# EAGLE schematic IMU (EAGLE 9.6.2)
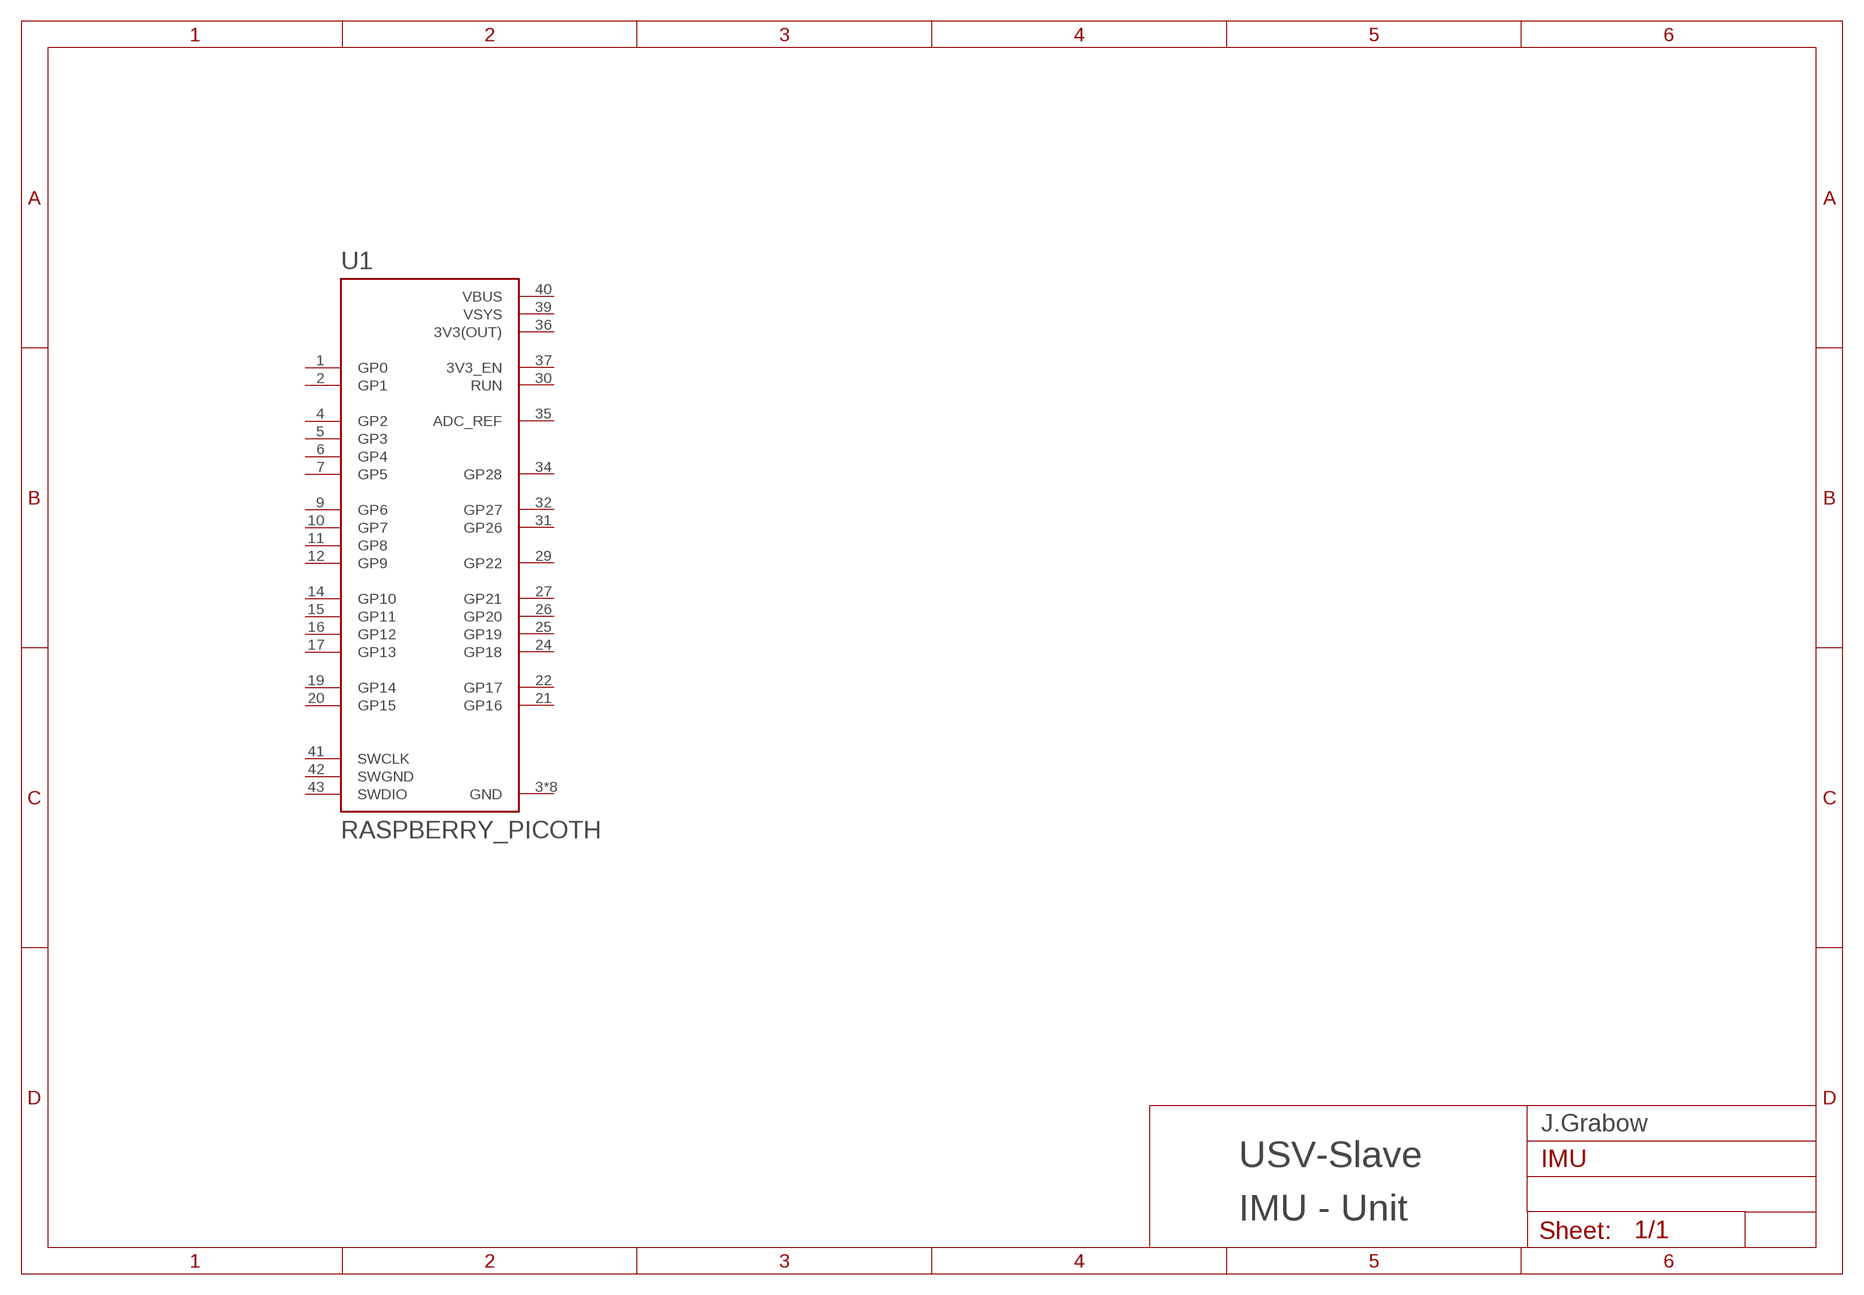
[diagram p0: schematic, sheet 1]

## Parts
U1  RASPBERRY_PICOTH  [PICO-PKG-TH]
Unconnected: U1.1(GP0) U1.2(GP1) U1.4(GP2) U1.5(GP3) U1.6(GP4) U1.7(GP5) U1.9(GP6) U1.10(GP7) U1.11(GP8) U1.12(GP9) U1.14(GP10) U1.15(GP11) U1.16(GP12) U1.17(GP13) U1.19(GP14) U1.20(GP15) U1.21(GP16) U1.22(GP17) U1.24(GP18) U1.25(GP19) U1.26(GP20) U1.27(GP21) U1.29(GP22) U1.30(RUN) U1.31(GP26) U1.32(GP27) U1.34(GP28) U1.35(ADC_REF) U1.37(3V3_EN) U1.41(SWCLK) U1.43(SWDIO)

## Notes on the sheet
- J.Grabow
- USV-Slave
- IMU - Unit

## Power pins joined to a net without a drawn wire
3V3(OUT): U1.36(3V3(OUT))
GND: U1.3(GND) U1.8(GND) U1.13(GND) U1.18(GND) U1.23(GND) U1.28(GND) U1.33(GND) U1.38(GND)
SWGND: U1.42(SWGND)
VBUS: U1.40(VBUS)
VSYS: U1.39(VSYS)

## Library data of the parts
U1 = RpiPico:RASPBERRY_PICO: Raspberry Pi Pico